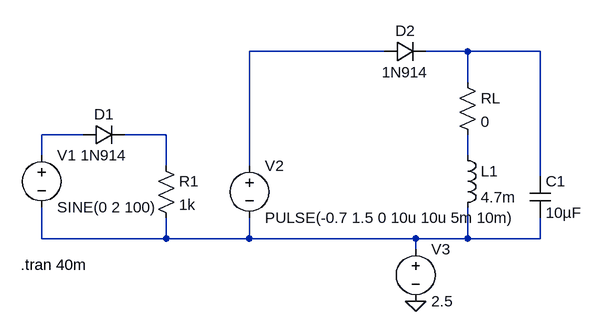
[diagram p0: schematic parallel_lc_res_ltspice.asc]
parallel_lc_res_ltspice.asc, the LTspice schematic file:
Version 4
SHEET 1 1076 680
WIRE 544 -32 336 -32
WIRE 672 -32 608 -32
WIRE 784 -32 672 -32
WIRE 672 16 672 -32
WIRE 80 96 16 96
WIRE 208 96 144 96
WIRE 16 128 16 96
WIRE 672 128 672 96
WIRE 208 144 208 96
WIRE 336 144 336 -32
WIRE 784 160 784 -32
WIRE 16 256 16 208
WIRE 208 256 208 224
WIRE 208 256 16 256
WIRE 336 256 336 224
WIRE 336 256 208 256
WIRE 592 256 336 256
WIRE 672 256 672 208
WIRE 672 256 592 256
WIRE 784 256 784 224
WIRE 784 256 672 256
WIRE 592 272 592 256
FLAG 592 352 0
SYMBOL diode 80 112 R270
WINDOW 0 32 32 VTop 2
WINDOW 3 0 32 VBottom 2
SYMATTR InstName D1
SYMATTR Value 1N914
SYMBOL res 192 128 R0
SYMATTR InstName R1
SYMATTR Value 1k
SYMBOL voltage 16 112 R0
WINDOW 123 0 0 Left 0
WINDOW 39 0 0 Left 0
SYMATTR InstName V1
SYMATTR Value SINE(0 2 100)
SYMBOL diode 544 -16 R270
WINDOW 0 32 32 VTop 2
WINDOW 3 0 32 VBottom 2
SYMATTR InstName D2
SYMATTR Value 1N914
SYMBOL voltage 336 128 R0
WINDOW 123 0 0 Left 0
WINDOW 39 0 0 Left 0
SYMATTR InstName V2
SYMATTR Value PULSE(-0.7 1.5 0 10u 10u 5m 10m)
SYMBOL ind 656 112 R0
SYMATTR InstName L1
SYMATTR Value 4.7m
SYMATTR SpiceLine Rser=0
SYMBOL cap 768 160 R0
SYMATTR InstName C1
SYMATTR Value 10µF
SYMBOL voltage 592 256 R0
WINDOW 123 0 0 Left 0
WINDOW 39 0 0 Left 0
SYMATTR InstName V3
SYMATTR Value 2.5
SYMBOL res 656 0 R0
SYMATTR InstName RL
SYMATTR Value 0
TEXT -16 296 Left 2 !.tran 40m

The netlist it stands for:
* parallel_lc_res_ltspice.asc
D1 N003 N004 1N914
R1 N004 N006 1k
V1 N003 N006 SINE(0 2 100)
D2 N001 N002 1N914
V2 N001 N006 PULSE(-0.7 1.5 0 10u 10u 5m 10m)
L1 N005 N006 4.7m Rser=0
C1 N002 N006 10µF
V3 N006 0 2.5
RL N002 N005 0
.model D D
.lib standard.dio
.tran 40m
.backanno
.end